# EAGLE design RPi Zero W Breakout 1.0 (EAGLE 9.3.1)
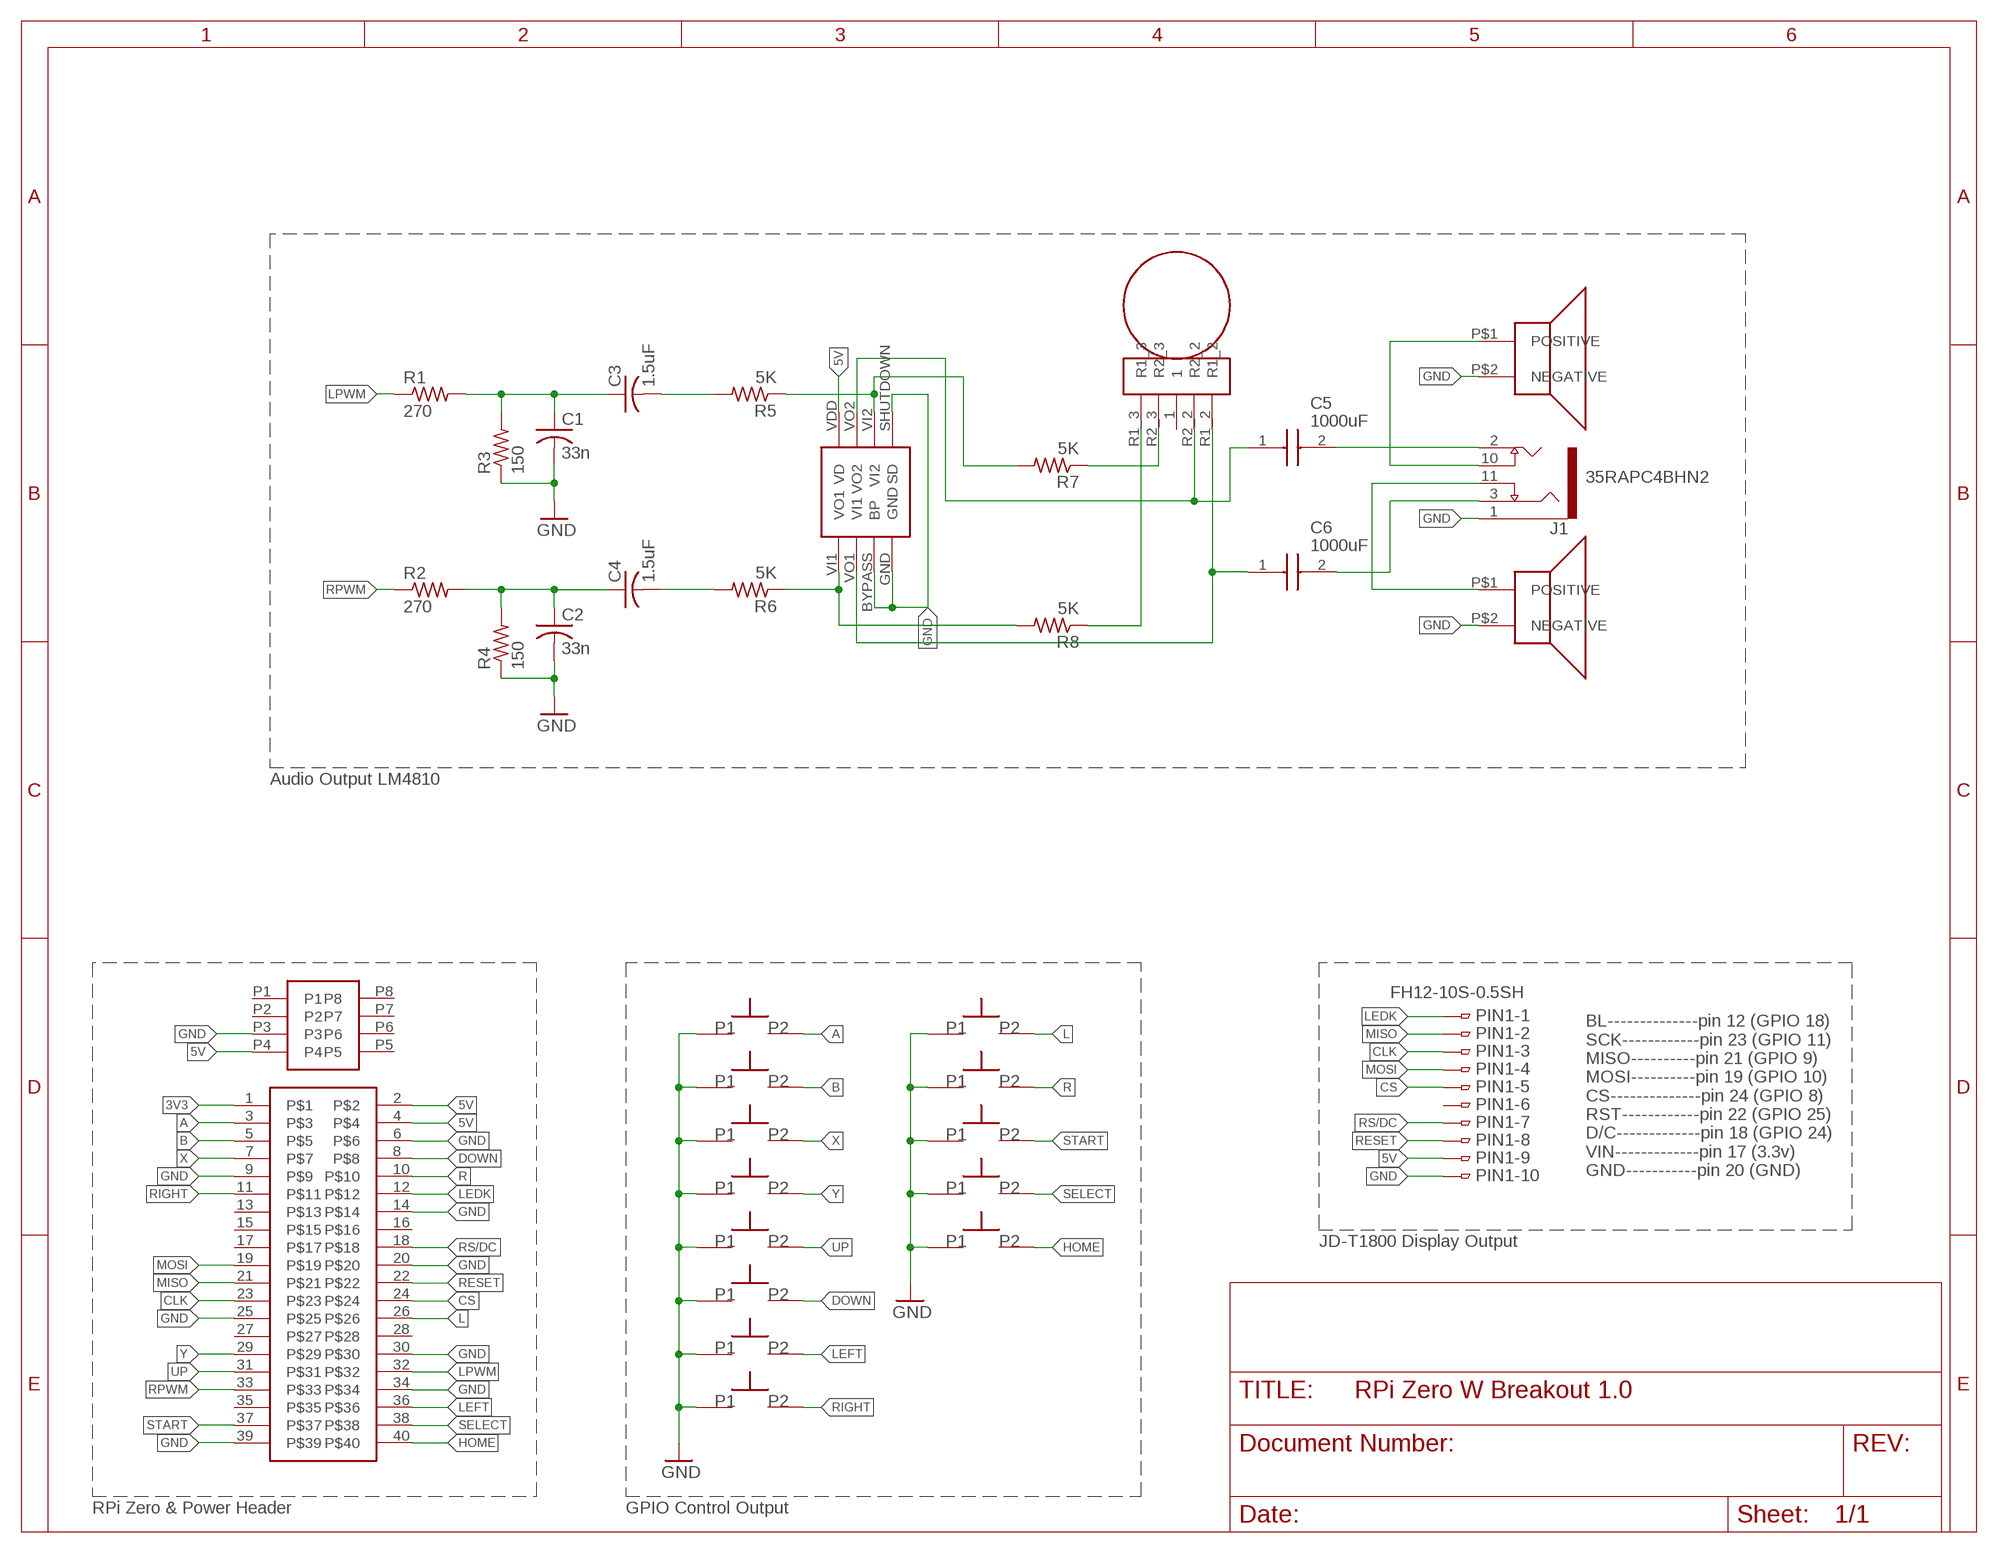
[diagram p0: schematic, sheet 1]

## Parts
A  SPST_TACTILE_SWITCH  [SPST_TACTILESWITCH_TL3301PF160QG]
B  SPST_TACTILESWITCH_TL3301PF160QG  [SPST_TACTILESWITCH_TL3301PF160QG]
C1  33n  C-USC0805K  [C0805K]
C2  33n  C-USC0805K  [C0805K]
C3  1.5uF  C-USC0805K  [C0805K]
C4  1.5uF  C-USC0805K  [C0805K]
C5  1000uF  UWT0J102MNL1GS  [UWT(8X10)]
C6  1000uF  UWT0J102MNL1GS  [UWT(8X10)]
DOWN  SPST_TACTILESWITCH_TL3301PF160QG  [SPST_TACTILESWITCH_TL3301PF160QG]
HOME  SPST_TACTILESWITCH_TL3301PF160QG  [SPST_TACTILESWITCH_TL3301PF160QG]
J1  35RAPC4BHN2  [SWITCHCRAFT_35RAPC4BHN2]
LEFT  SPST_TACTILESWITCH_TL3301PF160QG  [SPST_TACTILESWITCH_TL3301PF160QG]
LSPK  SP-1208  [SP-1208]
PIN1  FH12-10S-0.5SH  [FH12-10S-0.5SH]
R1  270  R-US_R0805  [R0805]
R2  270  R-US_R0805  [R0805]
R3  150  R-US_R0805  [R0805]
R4  150  R-US_R0805  [R0805]
R5  5K  R-US_R0805  [R0805]
R6  5K  R-US_R0805  [R0805]
R7  5K  R-US_R0805  [R0805]
R8  5K  R-US_R0805  [R0805]
RF  RK14J12A0A0K  [RK14J12A0A0K]
RIGHT  SPST_TACTILESWITCH_TL3301PF160QG  [SPST_TACTILESWITCH_TL3301PF160QG]
RSPK  SP-1208  [SP-1208]
SELECT  SPST_TACTILESWITCH_TL3301PF160QG  [SPST_TACTILESWITCH_TL3301PF160QG]
START  SPST_TACTILE_SWITCH  [SPST_TACTILESWITCH_TL3301PF160QG]
U$1  RPI_ZERO  [RPI_ZERO]
U$2  LM4810MM/NOPBCT-ND  [NOPBCT-ND]
U$3  M22-6340442  [M22-6340442]
U$4  SPST_TACTILE_SWITCHRIGHTANGLEBENT  [SPST_TACTILESWITCH_TL3360CF185Q_BENTFRAME]
U$5  SPST_TACTILE_SWITCHRIGHTANGLEBENT  [SPST_TACTILESWITCH_TL3360CF185Q_BENTFRAME]
UP  SPST_TACTILESWITCH_TL3301PF160QG  [SPST_TACTILESWITCH_TL3301PF160QG]
X  SPST_TACTILESWITCH_TL3301PF160QG  [SPST_TACTILESWITCH_TL3301PF160QG]
Y  SPST_TACTILESWITCH_TL3301PF160QG  [SPST_TACTILESWITCH_TL3301PF160QG]

## Nets
3V3: U$1.1
5V: PIN1.9 U$1.2 U$1.4 U$2.VDD(VD) U$3.P4
A: A.P$3 U$1.3
B: B.P$3 U$1.5
CLK: PIN1.3 U$1.23
CS: PIN1.5 U$1.24
DOWN: DOWN.P$3 U$1.8
GND: A.P$1 B.P$1 C1.2 C2.2 DOWN.P$1 HOME.P$1 J1.1 LEFT.P$1 LSPK.P$2(NEGATIVE) PIN1.10 R3.1 R4.1 RIGHT.P$1 RSPK.P$2(NEGATIVE) SELECT.P$1 START.P$1 U$1.6 U$1.9 U$1.14 U$1.20 U$1.25 U$1.30 U$1.34 U$1.39 U$2.BYPASS(BP) U$2.GND U$2.SHUTDOWN(SD) U$3.P3 U$4.P$1 U$5.P$1 UP.P$1 X.P$1 Y.P$1
HOME: HOME.P$3 U$1.40
L: U$1.26 U$4.P$2
LEDK: PIN1.1 U$1.12
LEFT: LEFT.P$3 U$1.36
LPWM: R1.1 U$1.32
MISO: PIN1.2 U$1.21
MOSI: PIN1.4 U$1.19
N$1: C1.1 C3.1 R1.2 R3.2
N$2: C2.1 C4.1 R2.2 R4.2
N$4: C3.2 R5.2
N$5: R7.1 RF.R2_3
N$6: C4.2 R6.2
N$7: R8.1 RF.R1_3
N$8: C6.1(+) RF.R1_2 U$2.VO1(VI1)
N$9: C5.1(+) RF.R2_2 U$2.VO2
N$10: C5.2(-) J1.2
N$11: C6.2(-) J1.3
N$12: J1.10 LSPK.P$1(POSITIVE)
N$13: J1.11 RSPK.P$1(POSITIVE)
N$14: R5.1 R7.2 U$2.VI2
N$15: R6.1 R8.2 U$2.VI1(VO1)
R: U$1.10 U$5.P$2
RESET: PIN1.8 U$1.22
RIGHT: RIGHT.P$3 U$1.11
RPWM: R2.1 U$1.33
RS/DC: PIN1.7 U$1.18
SELECT: SELECT.P$3 U$1.38
START: START.P$3 U$1.37
UP: U$1.31 UP.P$3
X: U$1.7 X.P$3
Y: U$1.29 Y.P$3
Unconnected: PIN1.6 RF.1 U$1.13 U$1.15 U$1.16 U$1.17 U$1.27 U$1.28 U$1.35 U$3.P1 U$3.P2 U$3.P5 U$3.P6 U$3.P7 U$3.P8

## Notes on the sheet
- Audio Output LM4810
- BL--------------pin 12 (GPIO 18)
  SCK------------pin 23 (GPIO 11)
  MISO----------pin 21 (GPIO 9)
  MOSI----------pin 19 (GPIO 10)
  CS--------------pin 24 (GPIO 8)
  RST------------pin 22 (GPIO 25)
  D/C-------------pin 18 (GPIO 24)
  VIN-------------pin 17 (3.3v)
  GND-----------pin 20 (GND)
- JD-T1800 Display Output
- RPi Zero & Power Header | GPIO Control Output

## Library data of the parts
A START = switches:SPST_TACTILE_SWITCH: SMD SPST Tactile Switch
B DOWN HOME LEFT RIGHT SELECT UP X Y = switches:SPST_TACTILESWITCH_TL3301PF160QG: SMD SPST
C1-C4 = rcl:C-US: CAPACITOR, American symbol; SPICEPREFIX: C
C5 C6 = SamacSys_Parts:UWT0J102MNL1GS: Nichicon 1000uF +/-20% 6.3 V 5101-4 SMD Metal Can Aluminium Electrolytic Capacitor Source: Datasheet <https://componentsearchengine.com/Datasheets/1/UWT0J102MNL1GS.pdf>; DESCRIPTION: Nichicon 1000uF +/-20% 6.3 V 5101-4 SMD Metal Can Aluminium Electrolytic Capacitor; HEIGHT: mm; MANUFACTURER_NAME: Nichicon; MANUFACTURER_PART_NUMBER: UWT0J102MNL1GS; MOUSER_PART_NUMBER: 647-UWT0J102MNL1S
J1 = 35RAPC4BHN2:35RAPC4BHN2: Conn 3.5MM Stereo Jack F 5 POS Solder RA Thru-Hole 5 Terminal 1 Port; DESCRIPTION: Conn 3.5MM Stereo Jack F 5 POS Solder RA Thru-Hole 5 Terminal 1 Port; DIGI-KEY_PART_NUMBER: SC1459-ND; DIGI-KEY_PURCHASE_URL: https://www.digikey.com/product-detail/en/switchcraft-inc/35RAPC4BHN2/SC1459-ND/1288690?utm_source=snapeda&utm_medium=aggregator&utm_campaign=symbol; MF: Switchcraft; MP: 35RAPC4BHN2; PACKAGE: None
LSPK RSPK = SP-1208:SP-1208: SPEAKER 8OHM 250MW TOP PORT 63DB
PIN1 = con-hirose:FH12-10S-0.5S: 0.5mm Pitch Connectors For FPC/FFC Source: Data sheet <http://www.hirose.co.jp/cataloge_hp/e58605370.pdf>; MPN: FH12-10S-0.5SH(55); OC_FARNELL: 1324540; OC_NEWARK: 34M6152
R1-R8 = rcl:R-US_: RESISTOR, American symbol; SPICEPREFIX: R
RF = RK14J12A0A0K:RK14J12A0A0K: Potentiometers Dual Unit 14mm 3B insertion (2mm)
U$1 = RaspberryPi:RPI_ZERO
U$2 = LM4810MM:LM4810MM/NOPBCT-ND: Dual 105mW Headphone Amplifier with Active-High Shutdown Mode
U$3 = M22-6340442:M22-6340442: 8 Pin Header 2.0mm pitch
U$4 U$5 = switches:SPST_TACTILE_SWITCH: SMD SPST Tactile Switch; SPICEPREFIX: B

## Board
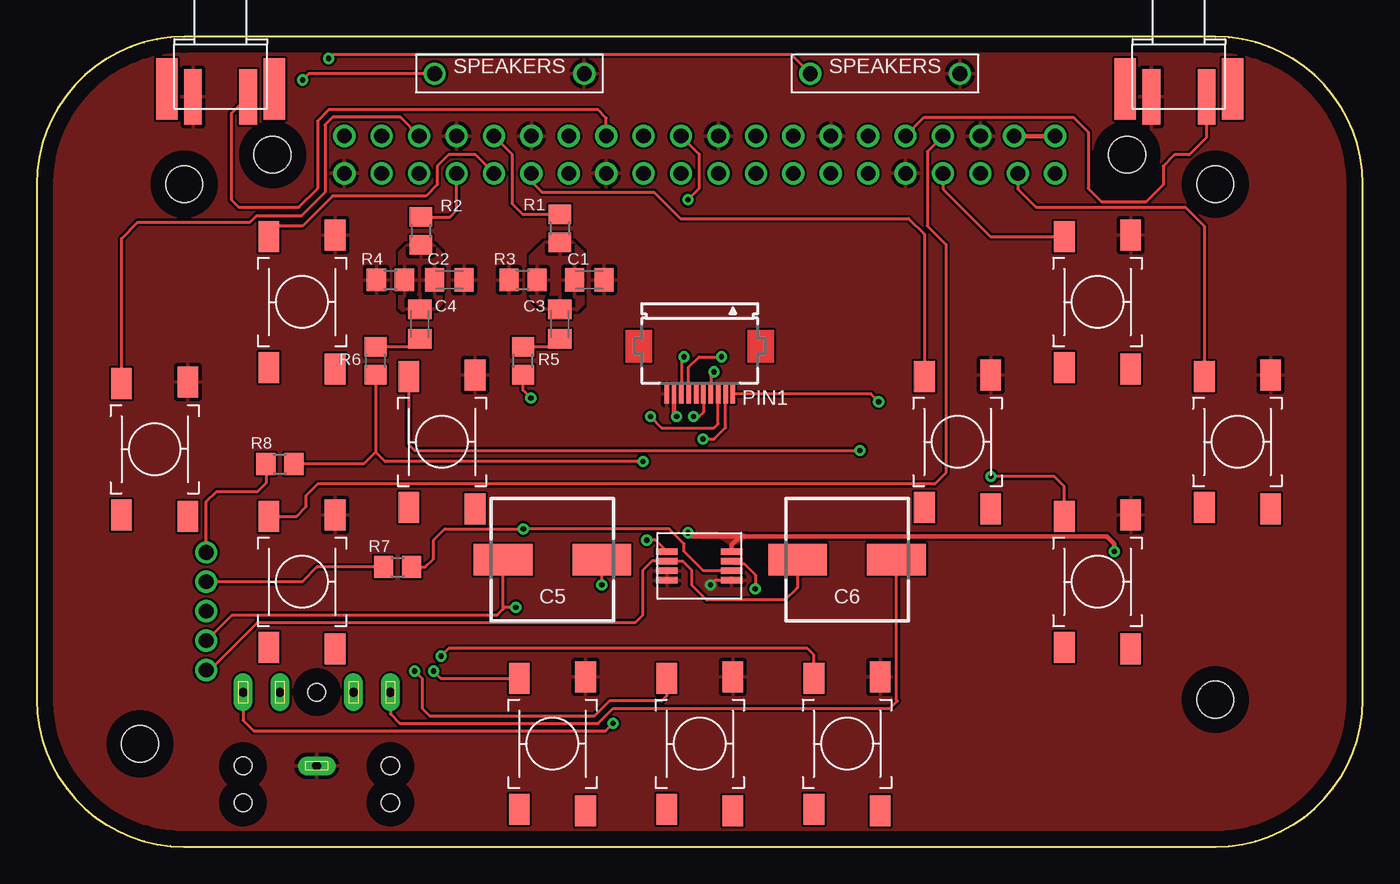
[diagram p1: board, top side]
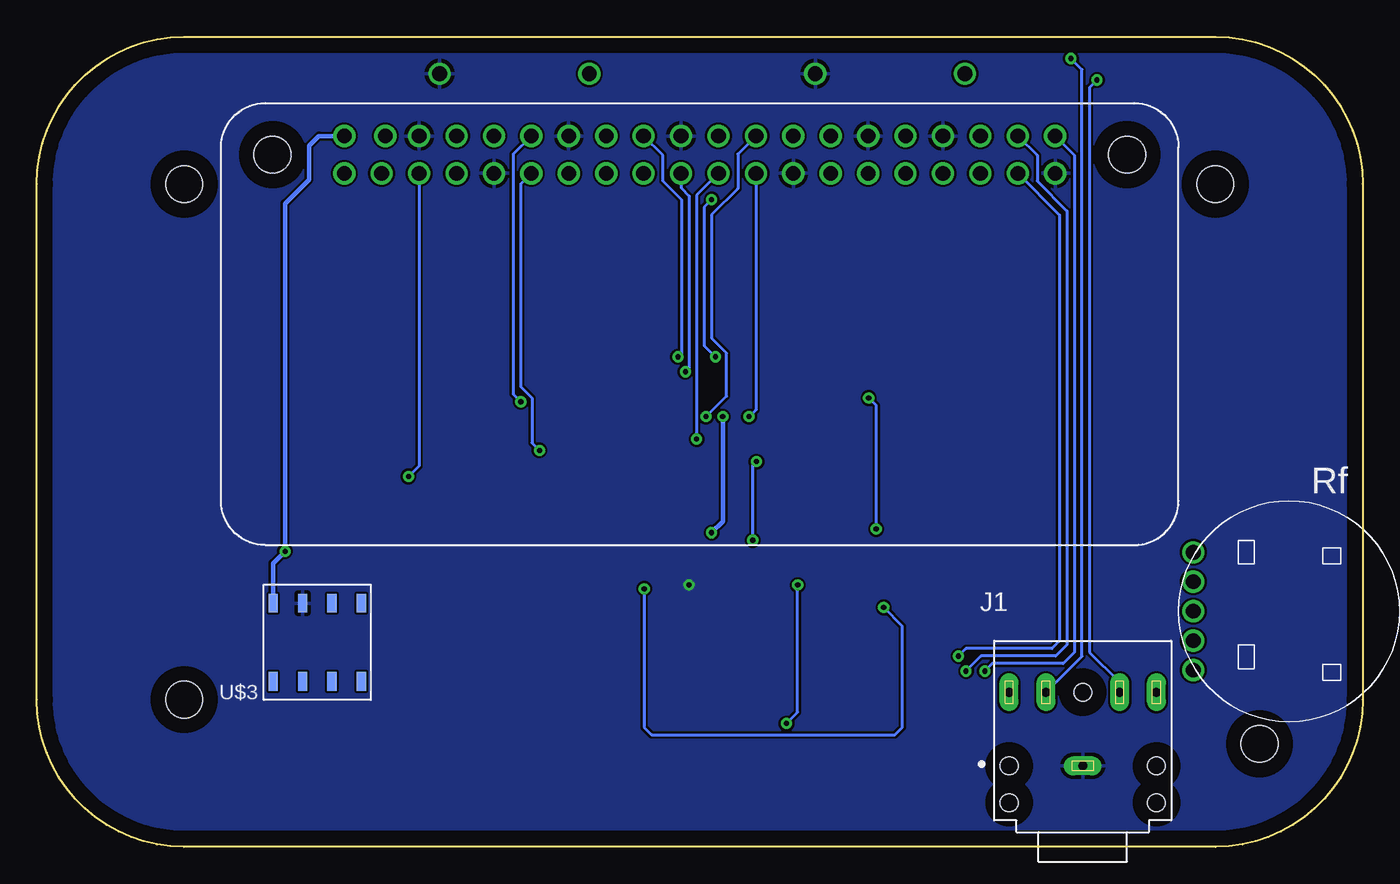
[diagram p2: board, bottom side, seen from below]

Size 90 x 55 mm. Coordinates in mm from the lower left corner, seen from the top.
Outline: 10,0 80,0 arc90 90,10 90,45 arc90 80,55 10,55 arc90 0,45 0,10 arc90 10,0
Copper layers (1*16): Top 0.035mm / dielectric 1.5mm / Bottom 0.035mm
Design rules "default": minimum track width 6mil, minimum drill 0.35mm, track to track 6mil, track to pad 6mil, pad to pad 6mil, via to via 6mil, smd to smd 6mil, copper to edge 40mil, drill to drill 6mil, minimum pad ring 10mil, minimum via ring 8mil, stop-mask expansion 4mil, vias tented up to drill 0mil, thermal gap 10mil
Holes 2.5 mm at 10,45 7,7 80,10 80,45

### Footprints (pad centres in the part's own frame; a part is rotated, then mirrored left to right if it is on the bottom)
SPST_TACTILESWITCH_TL3301PF160QG = smd 2.1 x 1.4: P$1 -4.55,2.25; P$2 4.55,2.25; P$3 -4.45,-2.25; P$4 4.45,-2.25
C0805K = smd 1.3 x 1.6: 1 -1,0; 2 1,0
UWT(8X10) = smd 4 x 2.15: 1 -3.35,0; 2 3.35,0
SWITCHCRAFT_35RAPC4BHN2 = drill 0.6 pad 1.3 long: 1 0,-1; 2 5,4; 3 -5,4; 10 2.5,4; 11 -2.5,4 | hole 1.2: 0,4; -5,-1; -5,-3.5; 5,-1; 5,-3.5
SP-1208 = drill 1: P$1 0,0; P$2 10.16,0
FH12-10S-0.5SH = smd 0.3 x 1.3: 1 -2.25,3.25; 2 -1.75,3.25; 3 -1.25,3.25; 4 -0.75,3.25; 5 -0.25,3.25; 6 0.25,3.25; 7 0.75,3.25; 8 1.25,3.25; 9 1.75,3.25; 10 2.25,3.25
R0805 = smd 1.3 x 1.5: 1 -0.95,0; 2 0.95,0
RK14J12A0A0K = drill 1: 1 0,-6.5; R1_2 4,-6.5; R1_3 -4,-6.5; R2_2 2,-6.5; R2_3 -2,-6.5
RPI_ZERO = drill 1: 1 -24.13,-1.27; 2 -24.13,1.27; 3 -21.59,-1.27; 4 -21.336,1.27; 5 -19.05,-1.27; 6 -19.05,1.27; 7 -16.51,-1.27; 8 -16.51,1.27; 9 -13.97,-1.27; 10 -13.97,1.27; 11 -11.43,-1.27; 12 -11.43,1.27; 13 -8.89,-1.27; 14 -8.89,1.27; 15 -6.35,-1.27; 16 -6.35,1.27; 17 -3.81,-1.27; 18 -3.81,1.27; 19 -1.27,-1.27; 20 -1.27,1.27; 21 1.27,-1.27; 22 1.27,1.27; 23 3.81,-1.27; 24 3.81,1.27; 25 6.35,-1.27; 26 6.35,1.27; 27 8.89,-1.27; 28 8.89,1.27; 29 11.43,-1.27; 30 11.43,1.27; 31 13.97,-1.27; 32 13.97,1.27; 33 16.51,-1.27; 34 16.51,1.27; 35 19.05,-1.27; 36 19.05,1.27; 37 21.59,-1.27; 38 21.59,1.27; 39 24.13,-1.27; 40 24.13,1.27 | hole 2.5: -29,0; 29,0
NOPBCT-ND = smd 0.45 x 1.45: BYPASS 0.75,-2.23; GND 1.4,-2.23; SHUTDOWN 1.4,2.17; VDD -0.55,2.17; VI1 -0.55,-2.23; VI2 0.75,2.17; VO1 0.1,-2.23; VO2 0.1,2.17
M22-6340442 = smd 1.27 x 0.635: P1 -2.54,2.54; P2 -2.54,0.54; P3 -2.54,-1.46; P4 -2.54,-3.46; P5 2.76,-3.46; P6 2.76,-1.46; P7 2.76,0.54; P8 2.76,2.54
SPST_TACTILESWITCH_TL3360CF185Q_BENTFRAME = smd 1.46 x 4.19: FRAME1 -3.65,-3.035; FRAME2 3.65,-3.035 | smd 1.205 x 3.76: P$1 -1.873,-3.58; P$2 1.873,-3.58

### Placement (x,y rotation side)
A  81.5,27.5 270 top
B  72,18 270 top
C1  37.5,38.5 0 top
C2  28,38.5 0 top
C3  35.5,35.5 270 top
C4  26,35.5 270 top
C5  35,19.5 0 top
C6  55,19.5 0 top
DOWN  18,18 270 top
HOME  45,7 270 top
J1  19,6.5 0 bottom
LEFT  8,27 270 top
LSPK  27,52.5 0 top
PIN1  45,34 180 top
R1  35.5,42 270 top
R2  26.07,41.82 270 top
R3  33,38.5 0 top
R4  24,38.5 0 top
R5  33,33 90 top
R6  23,33 90 top
R7  24.5,19 0 top
R8  16.5,26 0 top
RF  5,16 270 bottom
RIGHT  27.5,27.5 270 top
RSPK  52.5,52.5 0 top
SELECT  35,7 270 top
START  55,7 270 top
U$1  45,47 0 bottom
U$2  45,19.5 270 top
U$3  70.5,14 270 bottom
U$4  12.48,54.5 0 top
U$5  77.52,54.5 0 top
UP  18,37 270 top
X  72,37 270 top
Y  62.5,27.5 270 top

### Tracks (layer width: path | path; a pad name or v marks a point on that pad's centre or on a via)
5V  (via drill 0.35)
  Top 0.305: v73.15,20.07 73.15,20.57 72.64,21.08 47.75,21.08 | U$2.VDD 47.17,20.5 47.75,21.08 | U$1.4 U$1.2 | PIN1.9 43.25,29.39 v43.43,29.21 | v44.2,21.34 44.45,21.08 47.75,21.08
  Bottom 0.305: U$3.P4 73.96,19.26 v73.15,20.07 73.15,43.69 71.53,45.31 71.53,47.59 70.86,48.27 U$1.2 | v43.43,29.21 43.43,22.1 v44.2,21.34
  pour Top: 46.48,21.08 47.24,20.57 48.01,21.08
A
  Top 0.203: U$1.3 66.59,44.66 67.82,43.43 77.98,43.43 79.25,42.16 A.P$3
B  (via drill 0.35)
  Top 0.203: B.P$3 69.75,24.48 69.09,25.15 v64.77,25.15
  Bottom 0.203: U$1.5 64.05,25.87 v64.77,25.15
CLK  (via drill 0.35)
  Top 0.203: v41.66,29.21 42.42,28.45 45.97,28.45 46.25,28.72 PIN1.3
  Bottom 0.203: U$1.23 41.19,29.68 v41.66,29.21
CS  (via drill 0.35)
  Top 0.203: PIN1.5 45.25,29.5 44.96,29.21 v44.58,29.21
  Bottom 0.203: v44.58,29.21 43.18,30.61 43.18,33.53 44.2,34.54 44.2,42.93 42.42,44.7 42.42,47.04 U$1.24
DOWN
  Top 0.203: DOWN.P$3 17.62,22.45 18.29,23.11 18.29,23.88 19.05,24.64 60.96,24.64 61.72,25.4 61.72,40.89 60.45,42.16 60.45,47.21 U$1.8
GND  (via drill 0.35)
  Top 0.203: U$2.SHUTDOWN 46.04,18.1 v45.72,17.78
  pour Top (rank 6): -1,-1 90.5,-1 90.5,56 -1,56
  pour Bottom (rank 6): -2,-2 91.5,-2 91.5,57 -2,57
HOME  (via drill 0.35)
  Top 0.203: v25.65,11.94 26.16,11.43 26.16,9.4 26.67,8.89 37.85,8.89 38.86,9.91 42.42,9.91 42.75,10.24 HOME.P$3
  Bottom 0.203: U$1.40 19.56,46.96 19.56,42.67 | 19.56,42.67 | 19.56,42.67 19.56,13.21 20.32,12.45 25.15,12.45 v25.65,11.94
L
  Top 0.203: U$1.26 38.65,49.49 38.1,50.04 19.81,50.04 19.05,49.28 19.05,44.7 17.78,43.43 13.72,43.43 13.21,43.94 13.21,49.78 U$4.P$2
LEDK  (via drill 0.35)
  Top 0.203: v57.15,30.23 56.63,30.75 PIN1.1
  Bottom 0.203: U$1.12 57.66,47.04 57.66,30.73 v57.15,30.23
LEFT
  Top 0.203: U$1.36 24.69,49.53 20.07,49.53 19.56,49.02 19.56,44.45 17.96,42.85 14.91,42.85 14.48,42.42 6.86,42.42 5.75,41.31 LEFT.P$3
LPWM
  Top 0.203: U$1.32 32.26,47.04 32.26,43.69 33.02,42.93 33.04,42.95 R1.1
MISO  (via drill 0.35)
  Top 0.203: PIN1.2 46.75,28.46 45.97,27.69 v45.21,27.69
  Bottom 0.203: U$1.21 45.21,44.25 v45.21,27.69
MOSI  (via drill 0.35)
  Top 0.203: v45.97,32.26 45.75,32.03 PIN1.4
  Bottom 0.203: U$1.19 46.27,44.75 45.72,44.2 45.72,32.51 v45.97,32.26
N$1
  pour Top: 34.8,41.4 36.07,41.4 37.08,40.39 37.08,37.08 37.08,36.83 36.32,36.07 34.8,36.07 33.53,37.34 33.53,40.13
N$2
  pour Top: 25.4,41.15 26.67,41.15 27.43,40.39 27.43,36.83 26.67,36.07 25.15,36.07 24.64,36.58 24.64,40.39
N$4
  Top 0.203: C3.2 34.95,33.95 R5.2
N$5
  Top 0.203: R7.1 19,19 18,18 RF.R2_3
N$6
  Top 0.203: C4.2 25.45,33.95 R6.2
N$7
  Top 0.203: R8.1 15.55,24.69 14.99,24.13 12.19,24.13 11.5,23.44 RF.R1_3
N$8
  Top 0.203: RF.R1_2 11.75,12 14.99,15.24 40.64,15.24 41.15,15.75 41.15,18.8 41.75,19.4 U$2.VO1 43.85,19.4 44.45,18.8 44.45,17.78 45.47,16.76 50.8,16.76 51.56,17.53 | 51.65,17.61 51.56,17.53 | 51.56,17.53 51.65,17.61 | 51.65,17.61 C6.1
N$9  (via drill 0.35)
  Top 0.203: RF.R2_2 13.25,15.75 31.24,15.75 31.65,16.16 31.65,16.26 | 31.65,16.26 C5.1 | U$2.VO2 47.34,19.23 48,19.23 48.77,18.46 v48.77,17.53 | v32.51,16.26 31.65,16.26
  Bottom 0.203: v48.77,17.53 48.77,8.13 48.26,7.62 | 48.26,7.62 | 48.26,7.62 31.75,7.62 31.24,8.13 31.24,14.99 v32.51,16.26
N$10  (via drill 0.35)
  Top 0.203: J1.2 14,8.61 14.73,7.87 38.61,7.87 v39.12,8.38 | v38.35,17.78 C5.2
  Bottom 0.203: v39.12,8.38 38.35,9.14 v38.35,17.78
N$11
  Top 0.203: J1.3 24,9.02 24.64,8.38 38.1,8.38 39.12,9.4 57.91,9.4 58.42,9.91 58.35,9.98 C6.2
N$12  (via drill 0.35)
  Top 0.203: LSPK.P$1 18.46,52.5 v18.03,52.07
  Bottom 0.203: v18.03,52.07 18.54,51.56 18.54,13.21 16.6,11.26 16.6,10.6 J1.10
N$13  (via drill 0.35)
  Top 0.203: v19.81,53.53 20.09,53.81 51.19,53.81 RSPK.P$1
  Bottom 0.203: J1.11 19.05,12.95 19.05,52.77 v19.81,53.53
N$14  (via drill 0.35)
  Top 0.203: U$2.VI2 45.26,18.75 43.94,20.07 43.94,20.57 42.93,21.59 v33.02,21.59 27.69,21.59 26.92,20.83 26.92,19.56 26.37,19 R7.2 | v33.53,30.48 33,31.01 R5.1
  Bottom 0.203: v33.02,21.59 33.02,29.97 v33.53,30.48
N$15  (via drill 0.35)
  Top 0.203: R6.1 23,26.81 | R8.2 22.19,26 23,26.81 | U$2.VI1 41.99,20.83 v41.4,20.83 | v41.15,26.16 23.65,26.16 23,26.81
  Bottom 0.203: v41.4,20.83 41.4,25.91 v41.15,26.16
R
  Top 0.203: U$1.10 60.23,49.53 70.36,49.53 71.37,48.51 71.37,44.7 72.29,43.79 75.29,43.79 76.45,44.96 76.45,46.23 77.22,46.99 78.23,46.99 79.4,48.15 U$5.P$2
RESET  (via drill 0.35)
  Top 0.203: U$1.22 44.96,47.04 44.96,44.7 v44.2,43.94 | v43.94,33.27 43.75,33.08 PIN1.8
  Bottom 0.203: v44.2,43.94 44.7,43.43 44.7,34.04 v43.94,33.27
RIGHT  (via drill 0.35)
  Top 0.203: RIGHT.P$3 25.25,27.33 25.65,26.92 v55.88,26.92
  Bottom 0.203: U$1.11 57.15,45.01 57.15,43.69 | 57.15,43.69 | 57.15,43.69 57.15,31.24 56.39,30.48 56.39,27.43 v55.88,26.92
RPWM
  Top 0.203: R2.1 28.04,42.77 28.49,43.22 U$1.33
RS/DC  (via drill 0.35)
  Top 0.203: PIN1.7 44.25,32.57 44.96,33.27 v46.48,33.27
  Bottom 0.203: v46.48,33.27 46.23,33.53 46.23,43.94 47.5,45.21 47.5,46.96 U$1.18
SELECT  (via drill 0.35)
  Top 0.203: v26.92,11.94 27.41,11.45 SELECT.P$3
  Bottom 0.203: U$1.38 22.1,46.96 22.1,45.21 20.07,43.18 20.07,13.72 20.83,12.95 25.91,12.95 v26.92,11.94
START  (via drill 0.35)
  Top 0.203: v27.43,12.95 27.94,13.46 52.32,13.46 52.75,13.04 START.P$3
  Bottom 0.203: U$1.37 20.57,42.89 20.57,13.97 21.08,13.46 26.92,13.46 v27.43,12.95
UP
  Top 0.203: U$1.31 29.77,46.99 27.94,46.99 27.18,46.23 27.18,44.96 26.42,44.2 20.07,44.2 18.03,42.16 16.46,42.16 UP.P$3
X
  Top 0.203: U$1.7 61.51,44.66 64.72,41.45 X.P$3
Y
  Top 0.203: U$1.29 33.57,45.17 34.29,44.45 41.91,44.45 43.69,42.67 59.18,42.67 60.25,41.6 Y.P$3

### Text on the board
bNames: Rf
tValues: UP | X | LEFT | RIGHT | Y | A | DOWN | B | SELECT | HOME | START | RPi ZeroW Breakout / Rev 1 2019 Injoo Moon